# EAGLE design nerves_key4 (EAGLE 9.1.0)
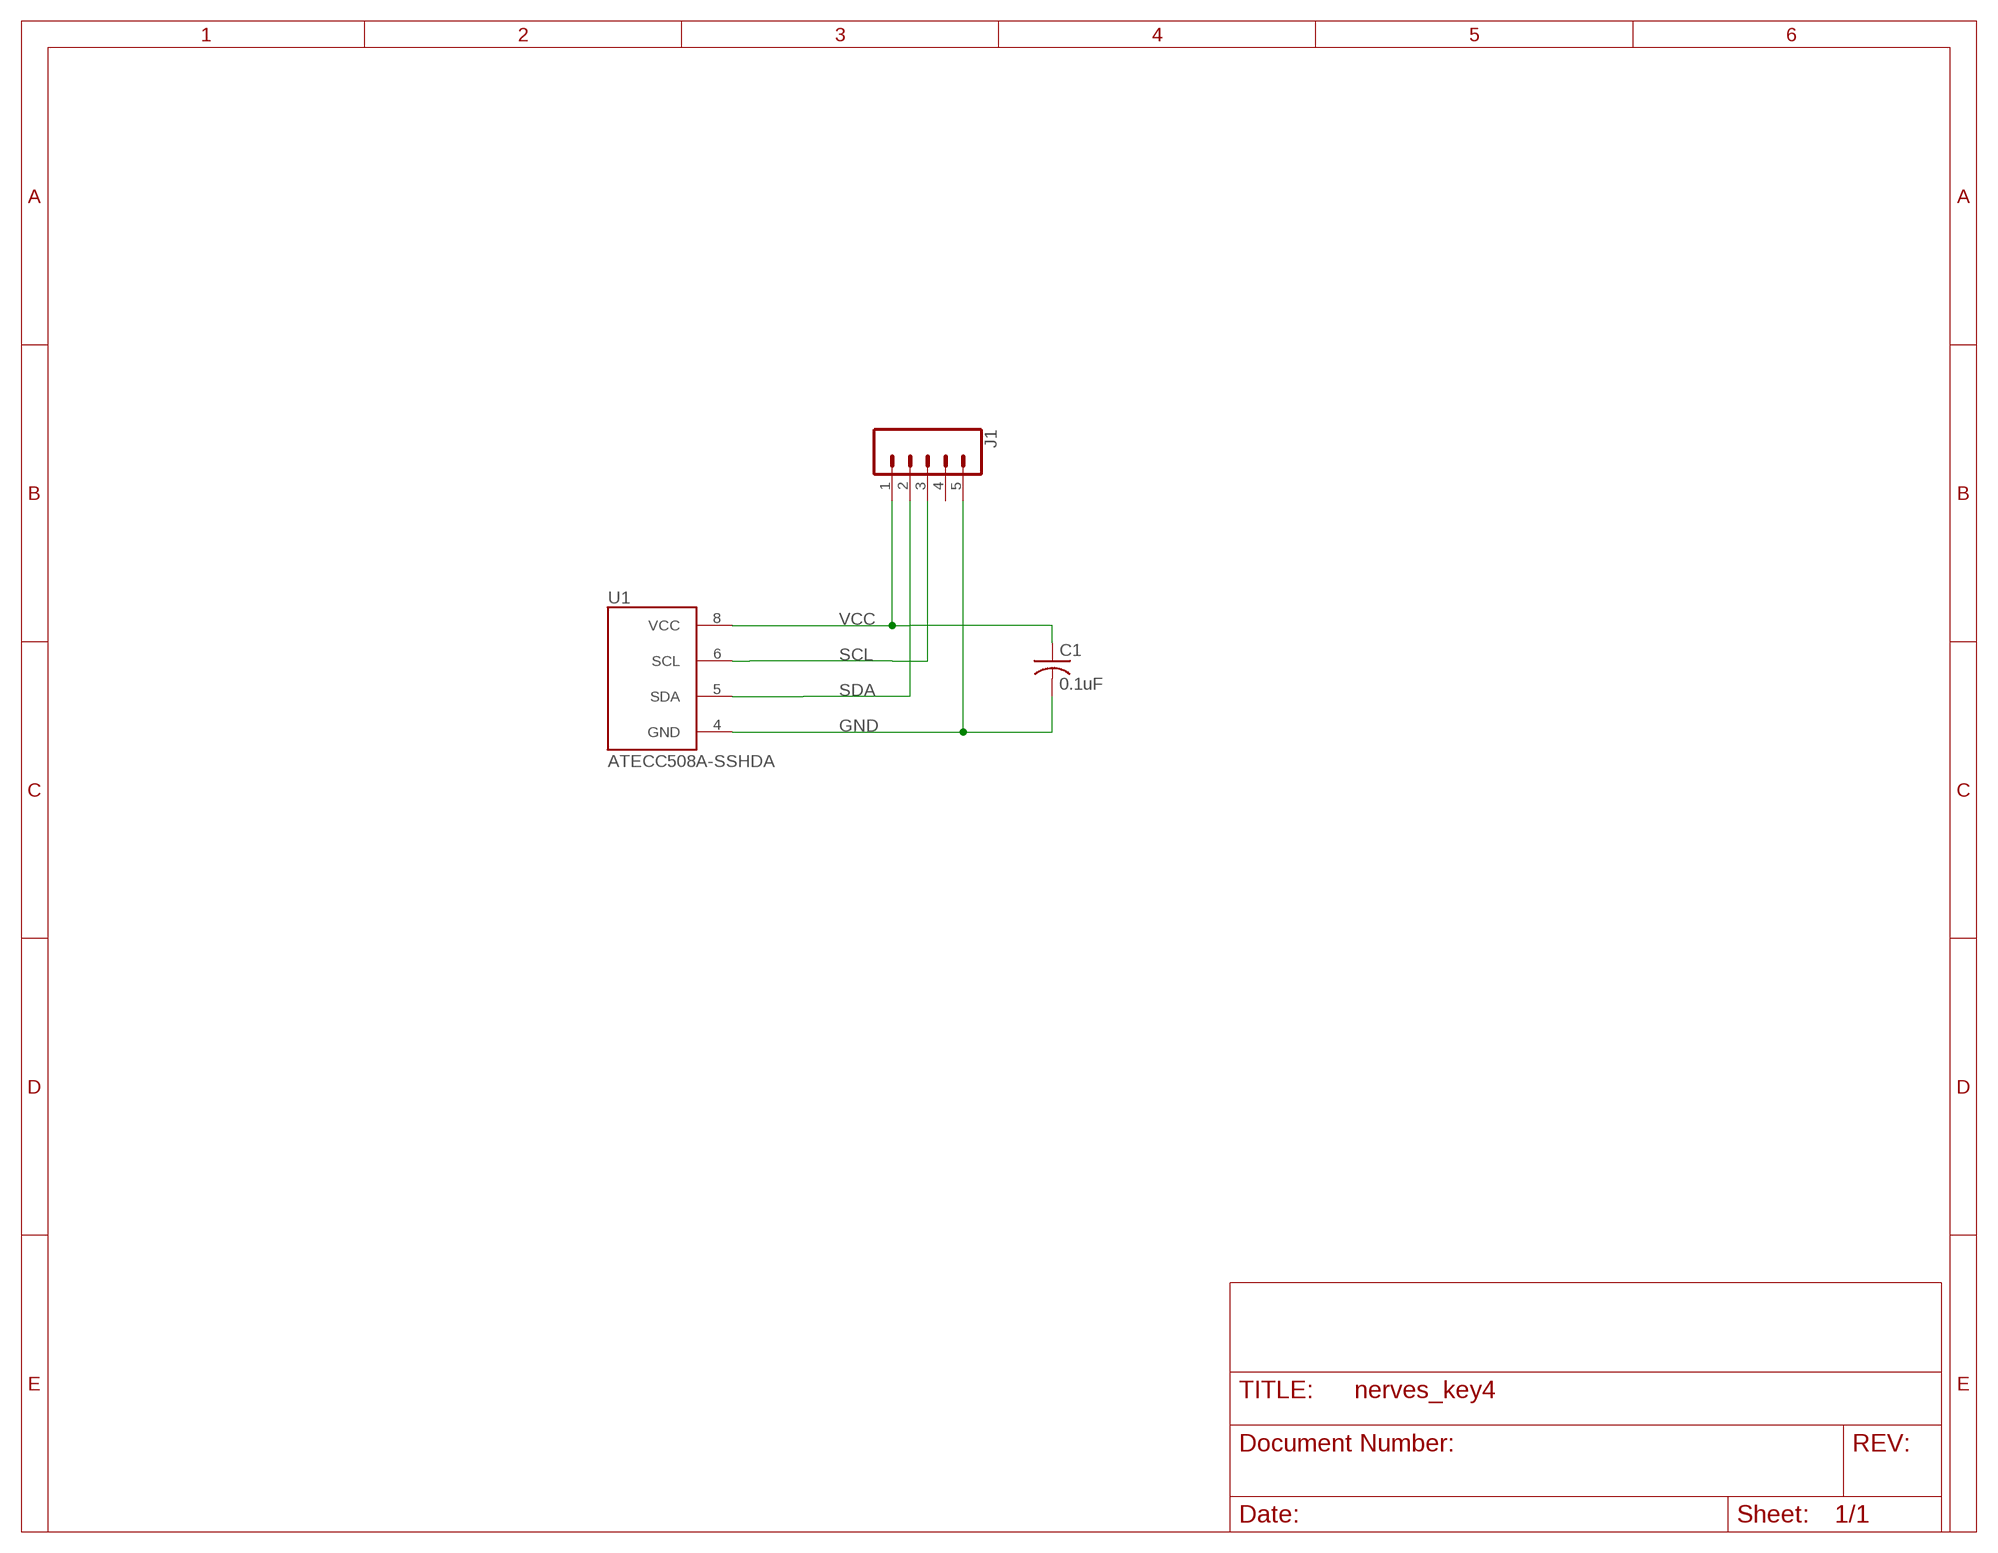
[diagram p0: schematic, sheet 1]

## Parts
C1  0.1uF  C-USC0603  [C0603]
J1  CONN_05  [1X05]
U1  ATECC508A-SSHDA  ATECC508ASOIC-8-NARROW  [SOIC127P625X175-8]

## Nets
GND: C1.2 J1.5 U1.4(GND)
SCL: J1.3 U1.6(SCL)
SDA: J1.2 U1.5(SDA)
VCC: C1.1 J1.1 U1.8(VCC)
Unconnected: J1.4

## Library data of the parts
C1 = rcl:C-US: CAPACITOR, American symbol; SPICEPREFIX: C
J1 = SparkFun-Connectors:CONN_05: Multi connection point. Often used as Generic Header-pin footprint for 0.1 inch spaced/style header connections On any of the 0.1 inch spaced packages, you can populate with these: Break Away Headers - Straight <https://www.sparkfun.com/products/116> (PRT-00116) Break Away Male Headers - Right Angle <https://www.sparkfun.com/products/553> (PRT-00553) Female Headers <https://www.sparkfun.com/products/115> (PRT-00115) Break Away Headers - Machine Pin <https://www.sparkfun.com/products/117> (PRT-00117) Break Away Female Headers - Swiss Machine Pin <https://www.sparkfun.com/products/743> (PRT-00743) For SCREWTERMINALS and SPRING TERMINALS visit here: Screw Terimnals on SparkFun.com <https://www.sparkfun.com/search/results?term=Screw+Terminals> (5mm/3.5mm/2.54mm spacing) This device is also useful as a general connection point to wire up your design to another part of your project. Our various solder wires solder well into these plated through hole pads. Hook-Up Wire - Assortment (Stranded, 22 AWG) <https://www.sparkfun.com/products/11375> (PRT-11375) Hook-Up Wire - Assortment (Solid Core, 22 AWG) <https://www.sparkfun.com/products/11367> (PRT-11367) View the entire wire category on our website here <https://www.sparkfun.com/categories/141> Special notes: Molex polarized connector foot print use with SKU : PRT-08231 with associated crimp pins and housings. 1MM SMD Version SKU: PRT-10208
U1 = cryptopi:ATECC508A

## Board
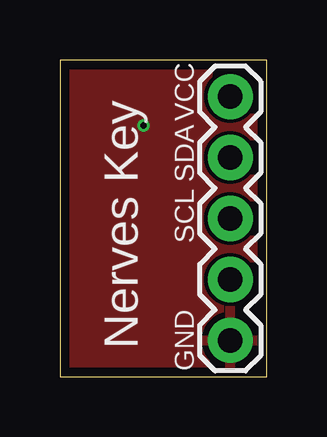
[diagram p1: board, top side]
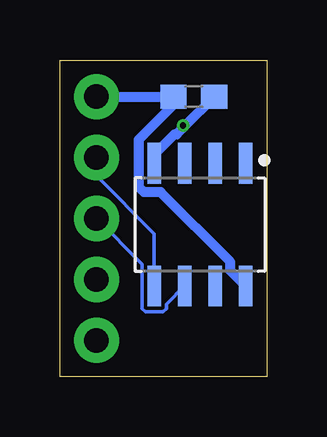
[diagram p2: board, bottom side, seen from below]

Size 8.64 x 13.21 mm. Coordinates in mm from the lower left corner, seen from the top.
Outline: 0,0 8.64,0 8.64,13.21 0,13.21 0,0
Copper layers (1*16): Top 0.035559375mm / dielectric 1.6mm / Bottom 0.035559375mm
Design rules "oshpark-2layer *": minimum track width 6mil, minimum drill 10mil, track to track 6mil, track to pad 6mil, pad to pad 6mil, via to via 6mil, smd to smd 6mil, copper to edge 15mil, drill to drill 6mil, minimum pad ring 5mil, minimum via ring 5mil, stop-mask expansion 2.5mil, vias tented up to drill 15mil, thermal gap 10mil

### Footprints (pad centres in the part's own frame; a part is rotated, then mirrored left to right if it is on the bottom)
C0603 = smd 1.1 x 1: 1 -0.85,0; 2 0.85,0
1X05 = drill 1.016 pad 1.88: 1 0,0; 2 2.54,0; 3 5.08,0; 4 7.62,0; 5 10.16,0
SOIC127P625X175-8 = smd 1.7 x 0.559: 1 -2.556,1.905; 2 -2.556,0.635; 3 -2.556,-0.635; 4 -2.556,-1.905; 5 2.556,-1.905; 6 2.556,-0.635; 7 2.556,0.635; 8 2.556,1.905

### Placement (x,y rotation side)
C1  3.05,11.68 0 bottom
J1  7.11,11.68 270 top
U1  2.79,6.35 270 bottom

### Tracks (layer width: path | path; a pad name or v marks a point on that pad's centre or on a via)
GND  (via drill 0.25)
  Bottom 0.152: v3.49,10.48 3.45,10.43
  Bottom 0.406: C1.2 3.45,10.43 3.77,10.11 3.86,10.11 4.7,9.27 U1.4
  pour Top: 0,13.21 8.64,13.21 8.64,0 0,0
SCL
  Bottom 0.152: J1.3 5.21,4.7 5.21,2.85 5.07,2.71 4.33,2.71 4.19,2.85 4.19,3.03 U1.6
SDA
  Bottom 0.152: U1.5 4.7,5.97 7.11,8.38 J1.2
VCC
  Bottom 0.406: J1.1 C1.1 3.9,11.34 5.33,9.9 5.33,7.91 5.13,7.7 4.43,7.7 1.52,4.79 1.52,4.43 U1.8

### Text on the board
tNames: VCC | SDA | Nerves Key | SCL | GND